# Altium schematic sheet IMX425_MB.SchDoc
size A4; SheetNumber: 1; SheetTotal: 1
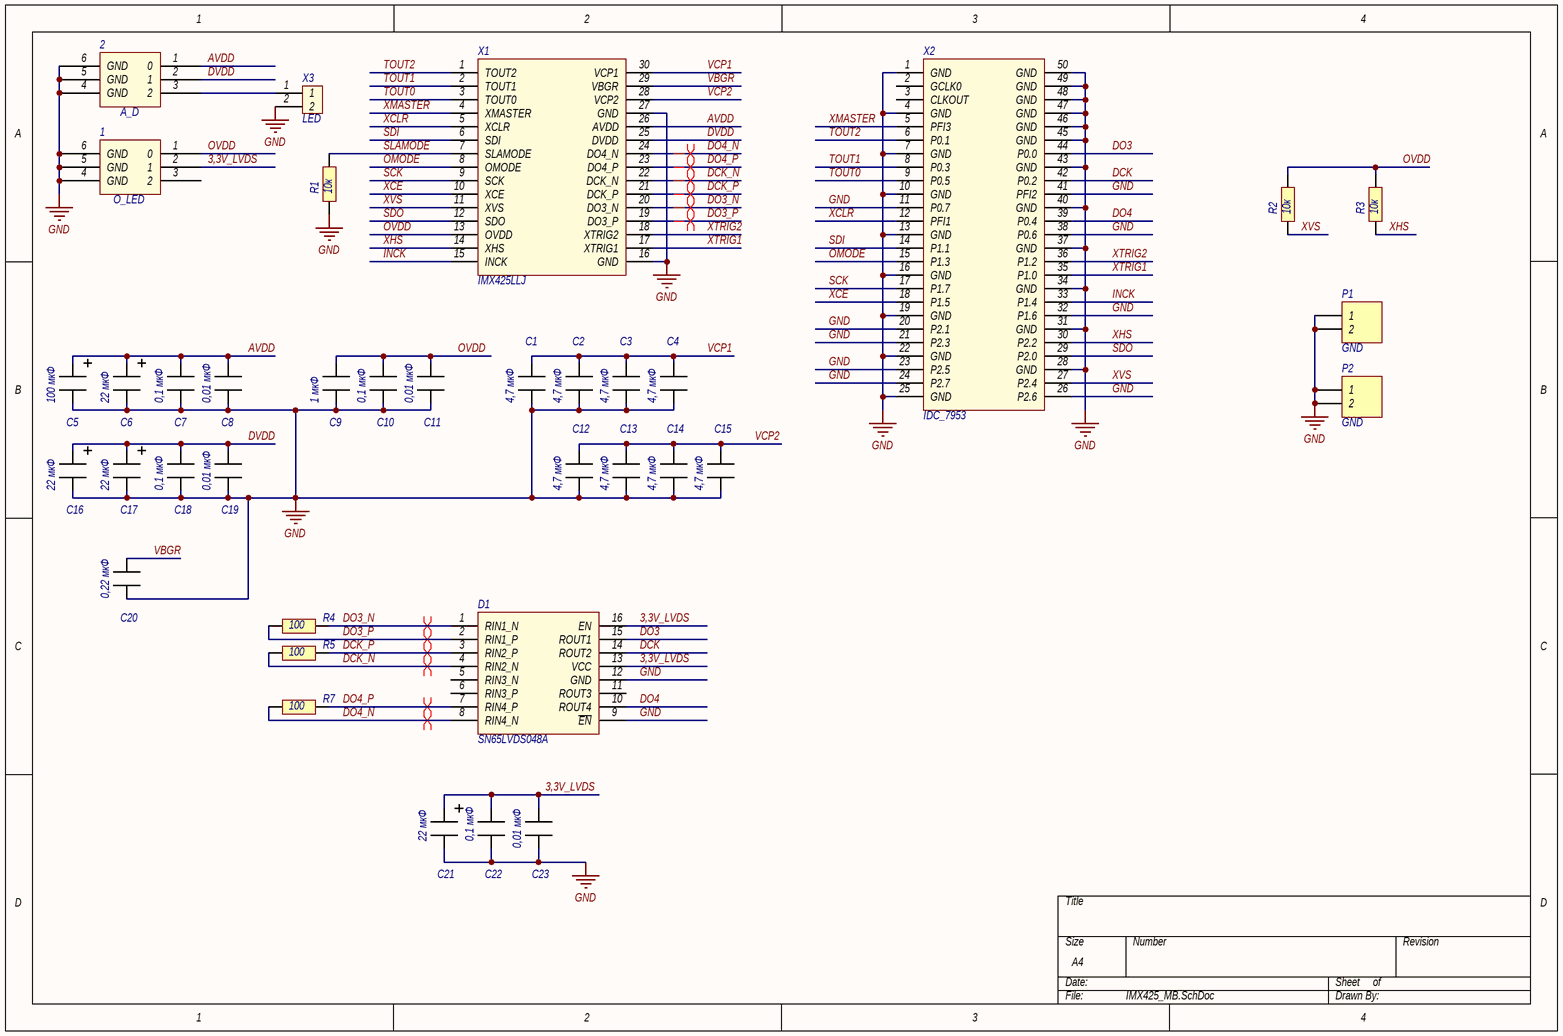
[diagram p0: IMX425_MB.SchDoc]

## Parts
1  O_LED  [POWER]
2  A_D  [POWER]
C1  4,7 мкФ  [CAP_SMALL]
C2  4,7 мкФ  [CAP_SMALL]
C3  4,7 мкФ  [CAP_SMALL]
C4  4,7 мкФ  [CAP_SMALL]
C5  100 мкФ  [Cap_0612_electrolitic]
C6  22 мкФ  [Cap_0511_electrolitic]
C7  0,1 мкФ  [CAP_SMALL]
C8  0,01 мкФ  [CAP_SMALL]
C9  1 мкФ  [CAP_SMALL]
C10  0,1 мкФ  [CAP_SMALL]
C11  0,01 мкФ  [CAP_SMALL]
C12  4,7 мкФ  [CAP_SMALL]
C13  4,7 мкФ  [CAP_SMALL]
C14  4,7 мкФ  [CAP_SMALL]
C15  4,7 мкФ  [CAP_SMALL]
C16  22 мкФ  [Cap_0511_electrolitic]
C17  22 мкФ  [Cap_0511_electrolitic]
C18  0,1 мкФ  [CAP_SMALL]
C19  0,01 мкФ  [CAP_SMALL]
C20  0,22 мкФ  [CAP_SMALL]
C21  22 мкФ  [Cap_0511_electrolitic]
C22  0,1 мкФ  [CAP_SMALL]
C23  0,01 мкФ  [CAP_SMALL]
D1  SN65LVDS048A  [SN65LVDS048A (4LVDS)]
P1  GND  [HDR1X2]
P2  GND  [HDR1X2]
R1  10к  [RES]
R2  10к  [RES]
R3  10к  [RES]
R4  100  [RES]
R5  100  [RES]
R7  100  [RES]
X1  IMX425LLJ  [IMX425LLJ_MEZ]
X2  IDC_7953  [IDC_7953]
X3  LED  [KLEMMNIK_2]

## Nets
GND: 1.4(GND) 1.5(GND) 1.6(GND) 2.4(GND) 2.5(GND) 2.6(GND) C1.2 C2.2 C3.2 C4.2 C5.2 C6.2 C7.2 C8.2 C9.2 C10.2 C11.2 C12.2 C13.2 C14.2 C15.2 C16.2 C17.2 C18.2 C19.2 C20.2 C21.2 C22.1 C23.1 D1.9(~{EN}) D1.12(GND) P1.1 P1.2 P2.1 P2.2 R1.2 X1.16(GND) X1.27(GND) X2.1(GND) X2.4(GND) X2.7(GND) X2.10(GND) X2.11(P0.7) X2.13(GND) X2.16(GND) X2.19(GND) X2.20(P2.1) X2.21(P2.3) X2.22(GND) X2.23(P2.5) X2.24(P2.7) X2.25(GND) X2.26(P2.6) X2.28(GND) X2.31(GND) X2.32(P1.6) X2.34(GND) X2.37(GND) X2.38(P0.6) X2.40(GND) X2.41(PFI2) X2.43(GND) X2.45(GND) X2.46(GND) X2.47(GND) X2.48(GND) X2.49(GND) X2.50(GND) X3.2
3,3V_LVDS: 1.2(1) C21.1 C22.2 C23.2 D1.13(VCC) D1.16(EN)
AVDD: 2.1(0) C5.1 C6.1 C7.1 C8.1 X1.26(AVDD)
DCK: D1.14(ROUT2) X2.42(P0.2)
DCK_N: D1.4(RIN2_N) R5.2 X1.22(DCK_N)
DCK_P: D1.3(RIN2_P) R5.1 X1.21(DCK_P)
DO3: D1.15(ROUT1) X2.44(P0.0)
DO3_N: D1.1(RIN1_N) R4.1 X1.20(DO3_N)
DO3_P: D1.2(RIN1_P) R4.2 X1.19(DO3_P)
DO4: D1.10(ROUT4) X2.39(P0.4)
DO4_N: D1.8(RIN4_N) R7.2 X1.24(DO4_N)
DO4_P: D1.7(RIN4_P) R7.1 X1.23(DO4_P)
DVDD: 2.2(1) C16.1 C17.1 C18.1 C19.1 X1.25(DVDD)
INCK: X1.15(INCK) X2.33(P1.4)
OMODE: X1.8(OMODE) X2.15(P1.3)
OVDD: 1.1(0) C9.1 C10.1 C11.1 R2.1 R3.1 X1.13(OVDD)
SCK: X1.9(SCK) X2.17(P1.7)
SDI: X1.6(SDI) X2.14(P1.1)
SDO: X1.12(SDO) X2.29(P2.0)
SLAMODE: R1.1 X1.7(SLAMODE)
TOUT0: X1.3(TOUT0) X2.9(P0.5)
TOUT1: X1.2(TOUT1) X2.8(P0.3)
TOUT2: X1.1(TOUT2) X2.6(P0.1)
VBGR: C20.1 X1.29(VBGR)
VCP1: C1.1 C2.1 C3.1 C4.1 X1.30(VCP1)
VCP2: C12.1 C13.1 C14.1 C15.1 X1.28(VCP2)
XCE: X1.10(XCE) X2.18(P1.5)
XCLR: X1.5(XCLR) X2.12(PFI1)
XHS: R3.2 X1.14(XHS) X2.30(P2.2)
XMASTER: X1.4(XMASTER) X2.5(PFI3)
XTRIG1: X1.17(XTRIG1) X2.35(P1.0)
XTRIG2: X1.18(XTRIG2) X2.36(P1.2)
XVS: R2.2 X1.11(XVS) X2.27(P2.4)
Net2_3: 2.3(2) X3.1

Not connected (* = marked no-connect by the designer): 1 3(2); D1 5(RIN3_N) 6(RIN3_P) 11(ROUT3); X2 2(GCLK0) 3(CLKOUT)

## Layout directives
differential pair: DCK_N, DCK_P, DO3_N, DO3_P, DO4_N, DO4_P

## Library data of the parts
1 2 = POWER
C1-C4 C7-C15 C18-C20 C22 C23 = CAP_SMALL
C5 = Cap_electrolotoc_0612
C6 C16 C17 C21 = Cap_electrolotoc_0511
D1 = SN65LVDS048A (4LVDS)
P1 P2 = Header 2: Header, 2-Pin; LatestRevisionDate: 17-Jul-2002; LatestRevisionNote: Re-released for DXP Platform.; Publisher: Altium Limited
R1-R5 R7 = RES
X1 = IMX425LLJ_MEZ
X3 = KLEMMNIK_2